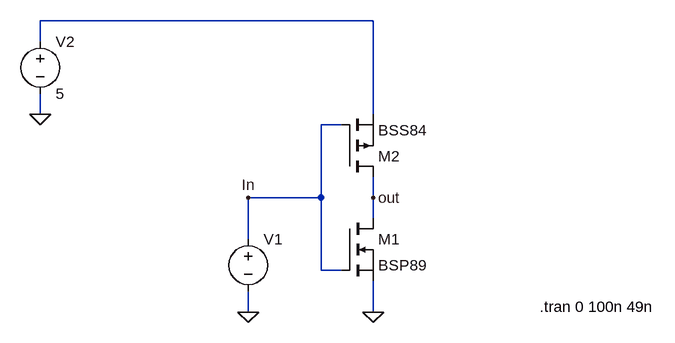
[diagram p0: schematic Inverter.asc]
Inverter.asc, the LTspice schematic file:
Version 4.1
SHEET 1 880 680
WIRE 240 -96 -272 -96
WIRE -272 -64 -272 -96
WIRE -272 48 -272 16
WIRE 240 48 240 -96
WIRE 192 64 160 64
WIRE 160 176 160 64
WIRE 160 176 48 176
WIRE 240 176 240 144
WIRE 240 208 240 176
WIRE 48 240 48 176
WIRE 160 288 160 176
WIRE 192 288 160 288
WIRE 48 352 48 320
WIRE 240 352 240 304
FLAG 240 352 0
FLAG 48 352 0
FLAG -272 48 0
FLAG 240 176 out
FLAG 48 176 In
SYMBOL nmos 192 208 R0
SYMATTR InstName M1
SYMATTR Value BSP89
SYMBOL pmos 192 144 M180
SYMATTR InstName M2
SYMATTR Value BSS84
SYMBOL voltage 48 224 R0
WINDOW 3 24 96 Invisible 2
WINDOW 123 0 0 Left 0
WINDOW 39 0 0 Left 0
SYMATTR Value PULSE(0 5 0 10n 10n 50n 100n 4)
SYMATTR InstName V1
SYMBOL voltage -272 -80 R0
WINDOW 123 0 0 Left 0
WINDOW 39 0 0 Left 0
SYMATTR InstName V2
SYMATTR Value 5
TEXT 496 344 Left 2 !.tran 0 100n 49n

The netlist it stands for:
* Inverter.asc
M1 out In 0 0 BSP89
M2 out In N001 N001 BSS84
V1 In 0 PULSE(0 5 0 10n 10n 50n 100n 4)
V2 N001 0 5
.model NMOS NMOS
.model PMOS PMOS
.lib standard.mos
.tran 0 100n 49n
.backanno
.end

* Results of the author's LTspice run, read from the files saved beside the schematic
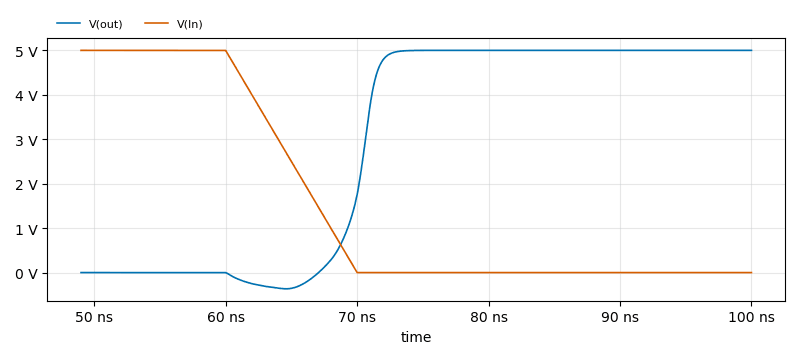
[diagram p1: Transient Analysis of Inverter.asc, plotted from the saved traces]
* Transient Analysis, 1 run:
*   V(out): min -365 mV, max 5 V, average 2.886 V, rms 3.78 V, last 5 V
*   V(In): min 0 V, max 5 V, average 1.569 V, rms 2.651 V, last 0 V